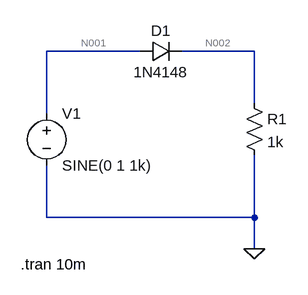
[diagram p0: schematic Draft2.asc]
Draft2.asc, the LTspice schematic file:
Version 4
SHEET 1 880 680
WIRE 224 64 80 64
WIRE 400 64 288 64
WIRE 400 144 400 64
WIRE 80 160 80 64
WIRE 80 320 80 240
WIRE 400 320 400 224
WIRE 400 320 80 320
WIRE 400 368 400 320
FLAG 400 368 0
SYMBOL voltage 80 144 R0
WINDOW 123 0 0 Left 0
WINDOW 39 0 0 Left 0
SYMATTR InstName V1
SYMATTR Value SINE(0 1 1k)
SYMBOL diode 224 80 R270
WINDOW 0 32 32 VTop 2
WINDOW 3 0 32 VBottom 2
SYMATTR InstName D1
SYMATTR Value 1N4148
SYMBOL res 384 128 R0
SYMATTR InstName R1
SYMATTR Value 1k
TEXT 40 392 Left 2 !.tran 10m

The netlist it stands for:
* Draft2.asc
V1 N001 0 SINE(0 1 1k)
D1 N001 N002 1N4148
R1 N002 0 1k
.model D D
.lib standard.dio
.tran 10m
.backanno
.end

* Results of the author's LTspice run, read from the files saved beside the schematic
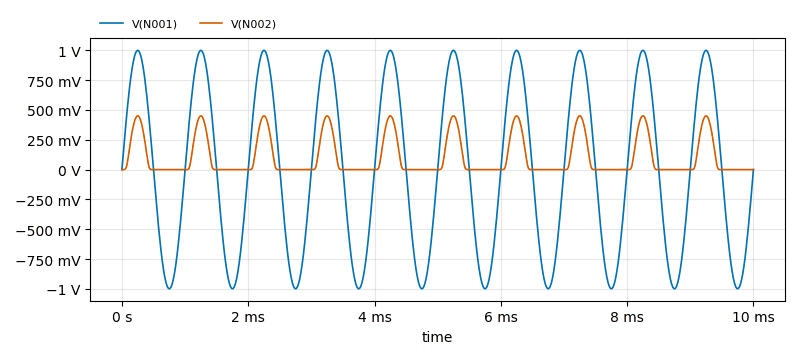
[diagram p1: Transient Analysis of Draft2.asc, plotted from the saved traces]
* Transient Analysis, 1 run:
*   V(N001): min -999.5 mV, max 1 V, average 273.7 µV, rms 707.1 mV, last 0 V
*   V(N002): min -26.03 µV, max 450.7 mV, average 102.1 mV, rms 189.1 mV, last 24.16 µV